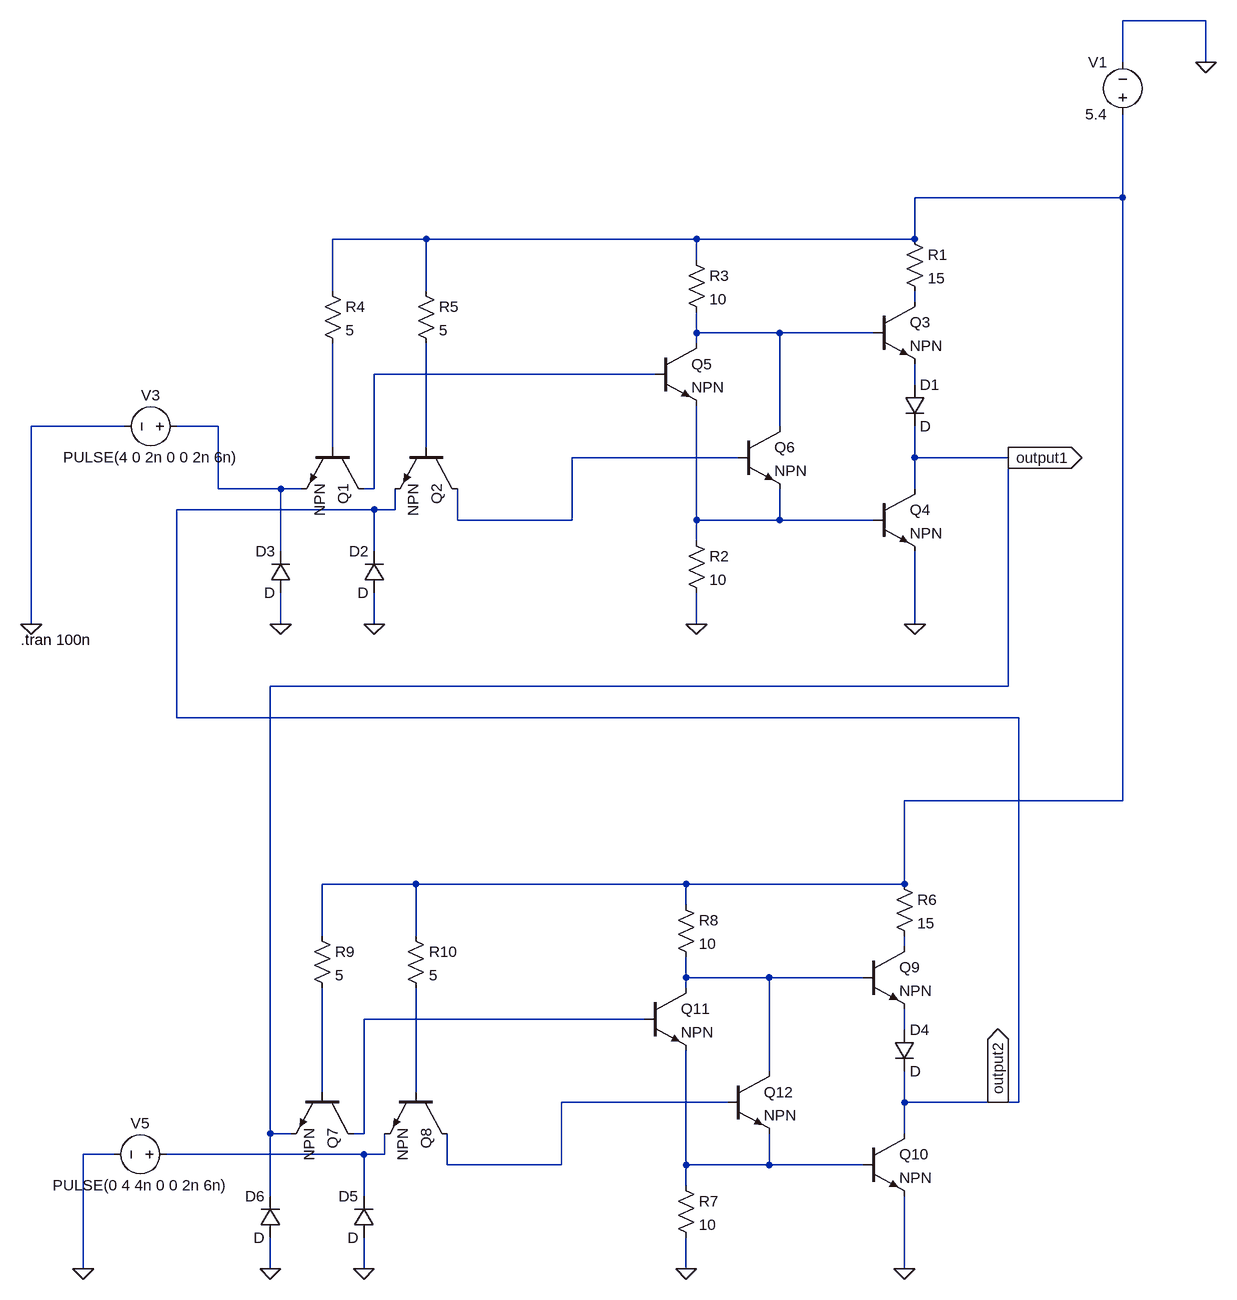
[diagram p0: schematic rs-flip-flop.asc]
rs-flip-flop.asc, the LTspice schematic file:
Version 4.1
SHEET 1 1236 1464
WIRE 1216 -496 1088 -496
WIRE 1088 -432 1088 -496
WIRE 1216 -432 1216 -496
WIRE 1088 -224 1088 -352
WIRE 1088 -224 768 -224
WIRE 16 -160 -128 -160
WIRE 432 -160 16 -160
WIRE 768 -160 768 -224
WIRE 768 -160 432 -160
WIRE 432 -128 432 -160
WIRE -128 -80 -128 -160
WIRE 16 -80 16 -160
WIRE 768 -64 768 -80
WIRE 432 -16 432 -48
WIRE 560 -16 432 -16
WIRE 704 -16 560 -16
WIRE 432 0 432 -16
WIRE 368 48 -64 48
WIRE 768 64 768 32
WIRE -448 128 -592 128
WIRE -304 128 -368 128
WIRE 560 128 560 -16
WIRE -128 160 -128 0
WIRE 16 160 16 0
WIRE 496 176 240 176
WIRE 768 176 768 128
WIRE 912 176 768 176
WIRE -304 224 -304 128
WIRE -208 224 -304 224
WIRE -176 224 -208 224
WIRE -64 224 -64 48
WIRE -64 224 -80 224
WIRE 768 224 768 176
WIRE -64 256 -368 256
WIRE -32 256 -32 224
WIRE -32 256 -64 256
WIRE 64 272 64 224
WIRE 240 272 240 176
WIRE 240 272 64 272
WIRE 432 272 432 96
WIRE 560 272 560 224
WIRE 560 272 432 272
WIRE 704 272 560 272
WIRE 432 304 432 272
WIRE -208 320 -208 224
WIRE -64 320 -64 256
WIRE -592 432 -592 128
WIRE -208 432 -208 384
WIRE -64 432 -64 384
WIRE 432 432 432 384
WIRE 768 432 768 320
WIRE 912 528 912 176
WIRE 912 528 -224 528
WIRE -368 576 -368 256
WIRE 928 576 -368 576
WIRE 1088 704 1088 -224
WIRE 1088 704 752 704
WIRE 0 832 -144 832
WIRE 416 832 0 832
WIRE 752 832 752 704
WIRE 752 832 416 832
WIRE 416 864 416 832
WIRE -144 912 -144 832
WIRE 0 912 0 832
WIRE 752 928 752 912
WIRE 416 976 416 944
WIRE 544 976 416 976
WIRE 688 976 544 976
WIRE 416 992 416 976
WIRE 352 1040 -80 1040
WIRE 752 1056 752 1024
WIRE 544 1120 544 976
WIRE -144 1152 -144 992
WIRE 0 1152 0 992
WIRE 480 1168 224 1168
WIRE 752 1168 752 1120
WIRE 896 1168 752 1168
WIRE 928 1168 928 576
WIRE 928 1168 896 1168
WIRE -224 1216 -224 528
WIRE -192 1216 -224 1216
WIRE -80 1216 -80 1040
WIRE -80 1216 -96 1216
WIRE 752 1216 752 1168
WIRE -464 1248 -512 1248
WIRE -80 1248 -384 1248
WIRE -48 1248 -48 1216
WIRE -48 1248 -80 1248
WIRE 48 1264 48 1216
WIRE 224 1264 224 1168
WIRE 224 1264 48 1264
WIRE 416 1264 416 1088
WIRE 544 1264 544 1216
WIRE 544 1264 416 1264
WIRE 688 1264 544 1264
WIRE 416 1296 416 1264
WIRE -224 1312 -224 1216
WIRE -80 1312 -80 1248
WIRE -512 1424 -512 1248
WIRE -224 1424 -224 1376
WIRE -80 1424 -80 1376
WIRE 416 1424 416 1376
WIRE 752 1424 752 1312
FLAG 768 432 0
FLAG 432 432 0
FLAG -64 432 0
FLAG -208 432 0
FLAG -592 432 0
FLAG 912 176 output1
IOPIN 912 176 Out
FLAG 752 1424 0
FLAG 416 1424 0
FLAG -80 1424 0
FLAG -224 1424 0
FLAG -512 1424 0
FLAG 896 1168 output2
IOPIN 896 1168 Out
FLAG 1216 -432 0
SYMBOL npn -80 160 R90
SYMATTR InstName Q1
SYMBOL npn 64 160 R90
SYMATTR InstName Q2
SYMBOL npn 704 -64 R0
SYMATTR InstName Q3
SYMBOL npn 704 224 R0
SYMATTR InstName Q4
SYMBOL res 752 -176 R0
SYMATTR InstName R1
SYMATTR Value 15
SYMBOL res 416 288 R0
SYMATTR InstName R2
SYMATTR Value 10
SYMBOL diode 752 64 R0
SYMATTR InstName D1
SYMBOL diode -48 384 R180
WINDOW 0 24 64 Left 2
WINDOW 3 24 0 Left 2
SYMATTR InstName D2
SYMBOL diode -192 384 R180
WINDOW 0 24 64 Left 2
WINDOW 3 24 0 Left 2
SYMATTR InstName D3
SYMBOL voltage -352 128 R90
WINDOW 0 -32 56 VBottom 2
WINDOW 3 32 56 VTop 2
WINDOW 123 0 0 Left 0
WINDOW 39 0 0 Left 0
SYMATTR InstName V3
SYMATTR Value PULSE(4 0 2n 0 0 2n 6n)
SYMBOL res 416 -144 R0
SYMATTR InstName R3
SYMATTR Value 10
SYMBOL res -144 -96 R0
SYMATTR InstName R4
SYMATTR Value 5
SYMBOL res 0 -96 R0
SYMATTR InstName R5
SYMATTR Value 5
SYMBOL npn 368 0 R0
SYMATTR InstName Q5
SYMBOL npn 496 128 R0
SYMATTR InstName Q6
SYMBOL npn -96 1152 R90
SYMATTR InstName Q7
SYMBOL npn 48 1152 R90
SYMATTR InstName Q8
SYMBOL npn 688 928 R0
SYMATTR InstName Q9
SYMBOL npn 688 1216 R0
SYMATTR InstName Q10
SYMBOL res 736 816 R0
SYMATTR InstName R6
SYMATTR Value 15
SYMBOL res 400 1280 R0
SYMATTR InstName R7
SYMATTR Value 10
SYMBOL diode 736 1056 R0
SYMATTR InstName D4
SYMBOL diode -64 1376 R180
WINDOW 0 24 64 Left 2
WINDOW 3 24 0 Left 2
SYMATTR InstName D5
SYMBOL diode -208 1376 R180
WINDOW 0 24 64 Left 2
WINDOW 3 24 0 Left 2
SYMATTR InstName D6
SYMBOL voltage -368 1248 R90
WINDOW 0 -32 56 VBottom 2
WINDOW 3 32 56 VTop 2
WINDOW 123 0 0 Left 0
WINDOW 39 0 0 Left 0
SYMATTR InstName V5
SYMATTR Value PULSE(0 4 4n 0 0 2n 6n)
SYMBOL res 400 848 R0
SYMATTR InstName R8
SYMATTR Value 10
SYMBOL res -160 896 R0
SYMATTR InstName R9
SYMATTR Value 5
SYMBOL res -16 896 R0
SYMATTR InstName R10
SYMATTR Value 5
SYMBOL npn 352 992 R0
SYMATTR InstName Q11
SYMBOL npn 480 1120 R0
SYMATTR InstName Q12
SYMBOL voltage 1088 -336 R180
WINDOW 0 24 96 Left 2
WINDOW 3 24 16 Left 2
WINDOW 123 0 0 Left 0
WINDOW 39 0 0 Left 0
SYMATTR InstName V1
SYMATTR Value 5.4
TEXT -608 456 Left 2 !.tran 100n

The netlist it stands for:
* rs-flip-flop.asc
Q1 N004 N007 N006 0 NPN
Q2 N009 N008 output2 0 NPN
Q3 N002 N003 N005 0 NPN
Q4 output1 N010 0 0 NPN
R1 N001 N002 15
R2 N010 0 10
D1 N005 output1 D
D2 0 output2 D
D3 0 N006 D
V3 N006 0 PULSE(4 0 2n 0 0 2n 6n)
R3 N001 N003 10
R4 N001 N007 5
R5 N001 N008 5
Q5 N003 N004 N010 0 NPN
Q6 N003 N009 N010 0 NPN
Q7 N013 N015 output1 0 NPN
Q8 N017 N016 N018 0 NPN
Q9 N011 N012 N014 0 NPN
Q10 output2 N019 0 0 NPN
R6 N001 N011 15
R7 N019 0 10
D4 N014 output2 D
D5 0 N018 D
D6 0 output1 D
V5 N018 0 PULSE(0 4 4n 0 0 2n 6n)
R8 N001 N012 10
R9 N001 N015 5
R10 N001 N016 5
Q11 N012 N013 N019 0 NPN
Q12 N012 N017 N019 0 NPN
V1 N001 0 5.4
.model D D
.lib standard.dio
.model NPN NPN
.model PNP PNP
.lib standard.bjt
.tran 100n
.backanno
.end